# Altium schematic sheet Smart Driver.SchDoc
size A4
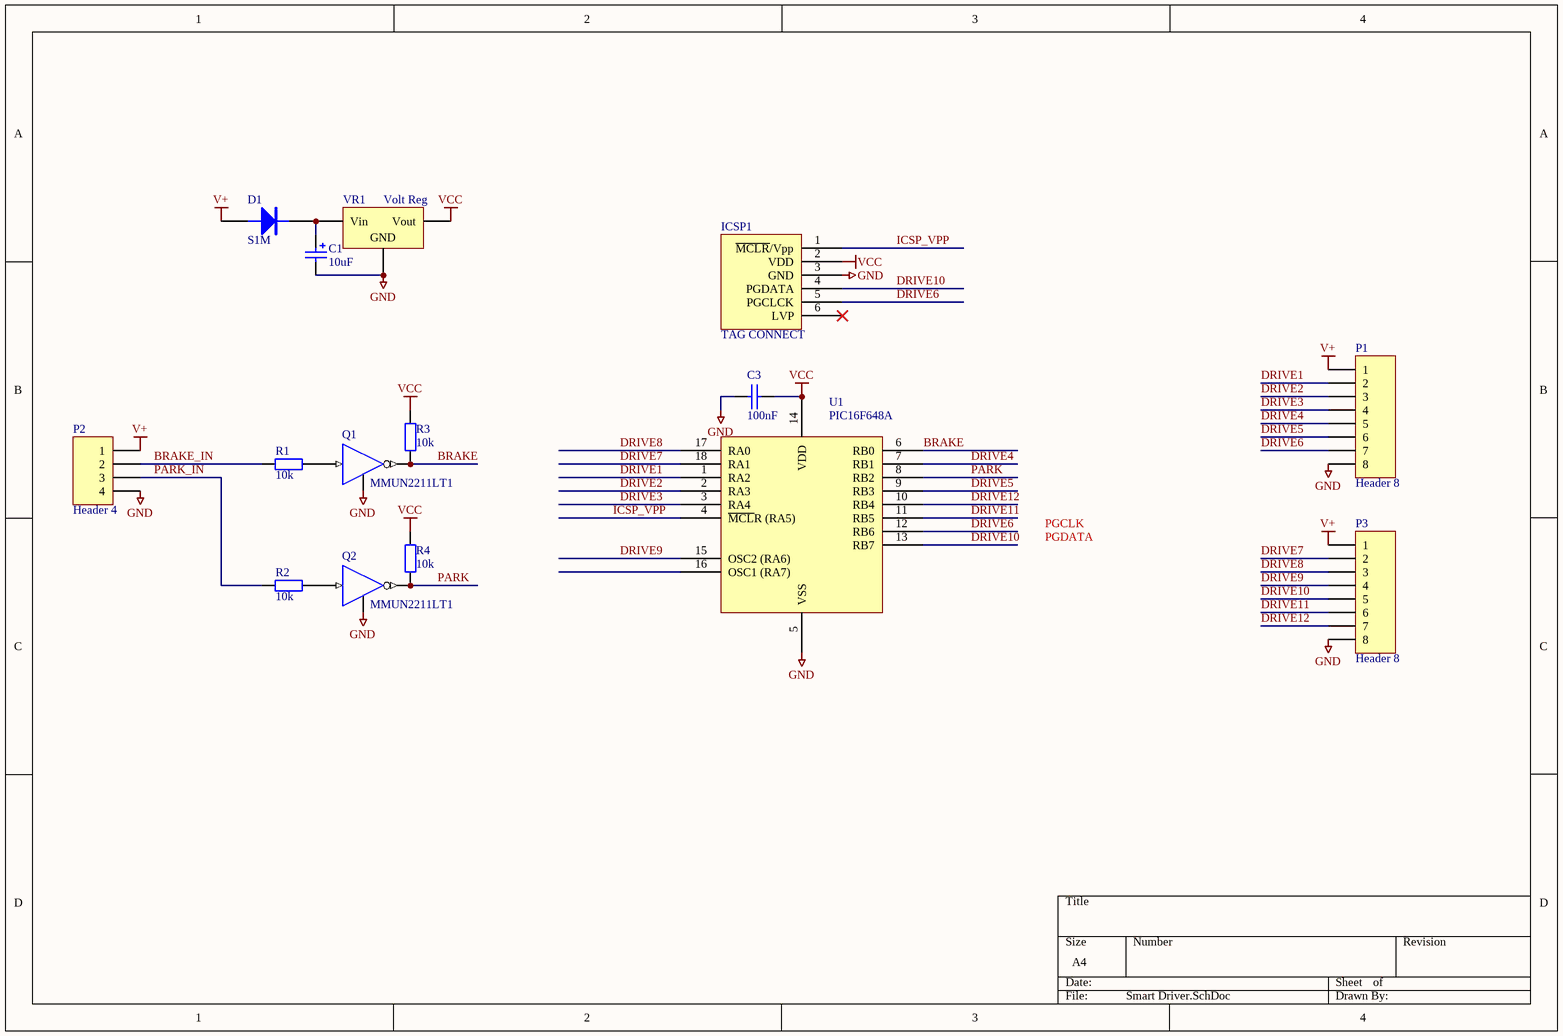
[diagram p0: Smart Driver.SchDoc]

## Parts
C1  10uF  [CAP ELECTRO SIZE-C]
C3  100nF  [CAP (3D) - 0805]
D1  S1M  [DO-214AC]
ICSP1  TAG CONNECT  [ICSP - TAG CONNECT TYPE2]
P1  Header 8  [HDR1X8]
P2  Header 4  [HDR1X4]
P3  Header 8  [HDR1X8]
Q1  MMUN2211LT1  [SOT23-3L]
Q2  MMUN2211LT1  [SOT23-3L]
R1  value 10k  [RES (3D) - 0805]  (hidden comment: Res2)
R2  value 10k  [RES (3D) - 0805]  (hidden comment: Res2)
R3  value 10k  [RES (3D) - 0805]  (hidden comment: Res2)
R4  value 10k  [RES (3D) - 0805]  (hidden comment: Res2)
U1  PIC16F648A  [SOIC-18]
VR1  Volt Reg  [SOT89]

## Nets
GND: C1.2 C3.1 ICSP1.3(GND) P1.8 P2.4 P3.8 Q1.2(E) Q2.2(E) U1.5(VSS) VR1.2(GND)
V+: D1.1(A) P1.1 P2.1 P3.1
VCC: C3.2 ICSP1.2(VDD) R3.2 R4.2 U1.14(VDD) VR1.3(Vout)
BRAKE: Q1.3(C) R3.1 U1.6(RB0)
BRAKE_IN: P2.2 R1.2
DRIVE1: P1.2 U1.1(RA2)
DRIVE2: P1.3 U1.2(RA3)
DRIVE3: P1.4 U1.3(RA4)
DRIVE4: P1.5 U1.7(RB1)
DRIVE5: P1.6 U1.9(RB3)
DRIVE6: ICSP1.5(PGCLCK) P1.7 U1.12(RB6)
DRIVE7: P3.2 U1.18(RA1)
DRIVE8: P3.3 U1.17(RA0)
DRIVE9: P3.4 U1.15(OSC2_(RA6))
DRIVE10: ICSP1.4(PGDATA) P3.5 U1.13(RB7)
DRIVE11: P3.6 U1.11(RB5)
DRIVE12: P3.7 U1.10(RB4)
ICSP_VPP: ICSP1.1(~{MCLR}/Vpp) U1.4(~{MCL}R_(RA5))
PARK: Q2.3(C) R4.1 U1.8(RB2)
PARK_IN: P2.3 R2.2
NetC1_1: C1.1 D1.2(K) VR1.1(Vin)
NetQ1_1: Q1.1(B) R1.1
NetQ2_1: Q2.1(B) R2.1

Not connected (* = marked no-connect by the designer): ICSP1 6(LVP)*; U1 16(OSC1_(RA7))

## Notes on the sheet
- PGCLK
- PGDATA

## Library data of the parts
C1 = Cap Pol: CAPACITOR POLARISED TAG B CASE; Manufacturer: Cornell Dubilier; Manufacturer Part No.: AVE106M25C12T-F; value: 10uF; Mouser Part no.: 598-AVE106M25C12T-F; Web link: http://au.mouser.com/ProductDetail/Cornell-Dubilier/AVE106M25C12T-F/?qs=sGAEpiMZZMtZ1n0r9vR22ZHbAXPxCSuozFHdo6NyKGw%3d
C3 = CAP: CAPACITOR SMD 0402; value: 100nF; Supplier 1: Mouser; Supplier Part Number 1: 810-CGJ3E2X7R1H104K
D1 = DIODE: DIODE, POWER; Manufacturer: TAIWAN SEMI; Mouser Part no.: 821-S1M; Manufacturer Part No.: S1M; value: S1M; Web link: http://au.mouser.com/ProductDetail/Taiwan-Semiconductor/S1M/?qs=sGAEpiMZZMtEwUVCuofpuOlSmRjzJonf%252bmrIm0%252bGbjE%3d
ICSP1 = ICSP - TAG CONNECT: Manufacturer: N/A - PCB ARTWORK; value: ICSP1; Manufacturer Part No.: N/A; Mouser Part no.: N/A; Web link: N/A
P1 P3 = Header 8: Header, 8-Pin; LatestRevisionDate: 17-Jul-2002; LatestRevisionNote: Re-released for DXP Platform.; Publisher: Altium Limited
P2 = Header 4: Header, 4-Pin; LatestRevisionDate: 17-Jul-2002; LatestRevisionNote: Re-released for DXP Platform.; Publisher: Altium Limited
Q1 Q2 = NPN DIGITAL TRANSISTOR: Manufacturer: ON Semiconductor; Manufacturer Part No.: MMUN2211LT1G; value: MMUN2211LT1G; Mouser Part no.: 863-MMUN2211LT1G; Web Link: http://au.mouser.com/ProductDetail/ON-Semiconductor/MMUN2211LT1G/?qs=ZpPixqFcBtxv5UXtkbhqPw%3d%3d
R1-R4 = Res2: Resistor
U1 = PIC16F87/88: PIC16F88; Manufacturer: Microchip Technology; Manufacturer Part No.: PIC16F88-E/SS; Mouser Part no.: 579-PIC16F88-E/SS; Farnell Part no.: 9761519; value: PIC16F88; Web link: http://au.mouser.com/ProductDetail/Microchip-Technology/PIC16F88-E-SS/?qs=sGAEpiMZZMvu0Nwh4cA1waDrdroEY0RCb%252bRi%252b4Dz0K0%3d
VR1 = Volt Reg: Voltage Regulator; pin to pad: 1>3 3>1